# EAGLE design eeprom (EAGLE 9.6.2)
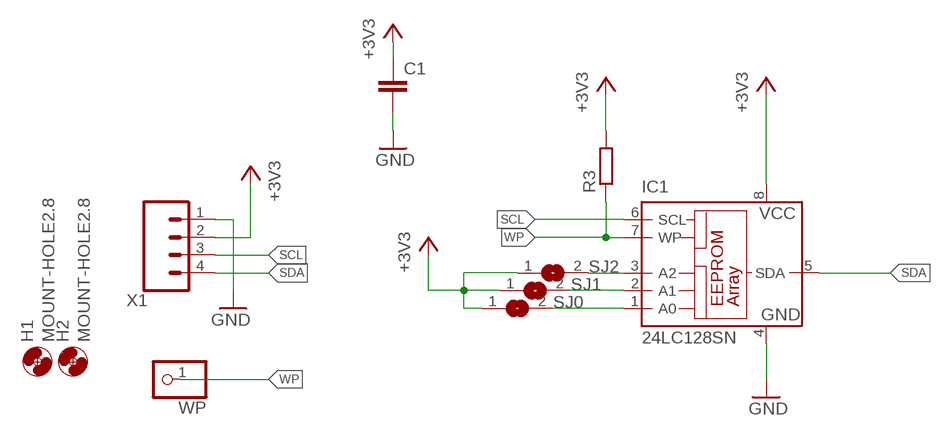
[diagram p0: schematic, sheet 1]

## Parts
C1  C-EUC0805  [C0805]
H1  MOUNT-HOLE2.8  [2,8]
H2  MOUNT-HOLE2.8  [2,8]
IC1  24LC128SN  [SO-08]
R3  R-EU_R0805  [R0805]
SJ0  SJ  [SJ]
SJ1  SJ  [SJ]
SJ2  SJ  [SJ]
WP  PINHD-1X1  [1X01]
X1  JST-XH-04-PIN-ROUND-PAD  [JST-XH-04-PACKAGE-ROUND-PAD]

## Nets
+3V3: C1.1 IC1.8(VCC) R3.2 SJ0.1 SJ1.1 SJ2.1 X1.2
GND: C1.2 IC1.4(GND) X1.1
N$1: IC1.3(A2) SJ2.2
N$2: IC1.2(A1) SJ1.2
N$3: IC1.1(A0) SJ0.2
SCL: IC1.6(SCL) X1.3
SDA: IC1.5(SDA) X1.4
WP: IC1.7(WP) R3.1 WP.1

## Library data of the parts
C1 = rcl:C-EU: CAPACITOR, European symbol; SPICEPREFIX: C
H1 H2 = holes:MOUNT-HOLE: MOUNTING HOLE with drill center marker
IC1 = microchip:24*: Serial EEPROM I2C; MF: MICROCHIP; MPN: 24LC128-I/SNG; OC_FARNELL: 9757937; OC_NEWARK: 30H1511
R3 = rcl:R-EU_: RESISTOR, European symbol; SPICEPREFIX: R
SJ0 SJ1 SJ2 = jumper:SJ: SMD solder JUMPER
WP = pinhead:PINHD-1X1: PIN HEADER
X1 = JST-XH-2.54:JST-XH-04-PIN: JST XH Connector 2 Pin Wire to board connector. Pitch: 2,54 mm, (0.100") Number of pins: 4 Created by Rembrandt Electronics www.rembrandtelectronics.com

## Board
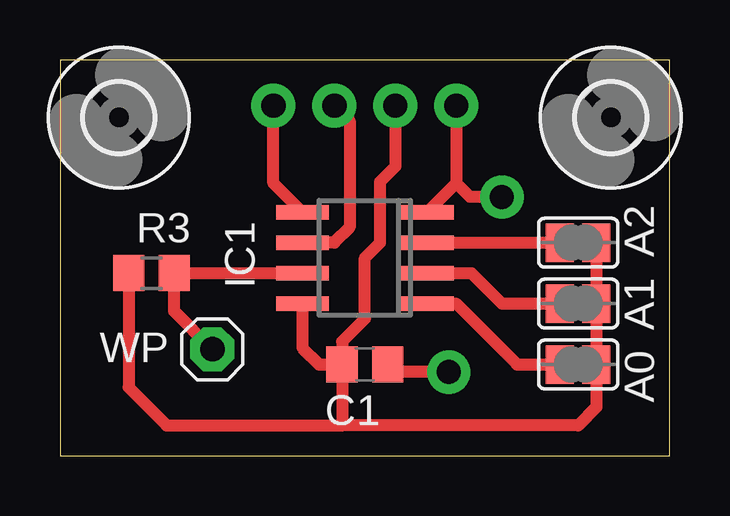
[diagram p1: board, top side]
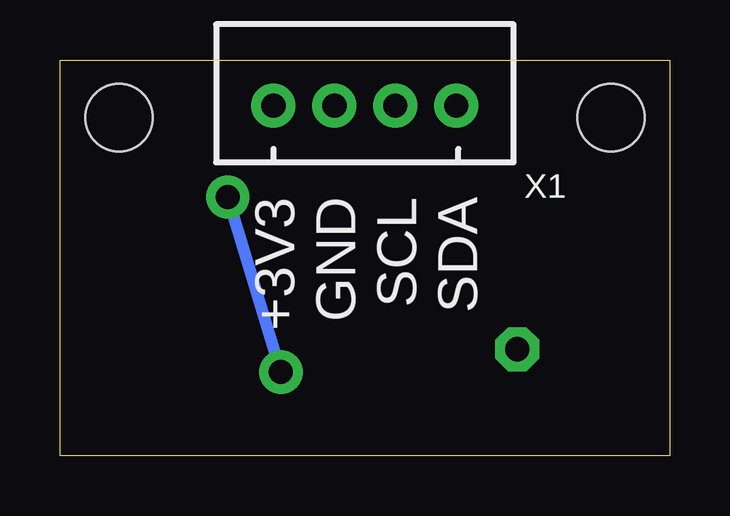
[diagram p2: board, bottom side, seen from below]

Size 25.4 x 16.51 mm. Coordinates in mm from the lower left corner, seen from the top.
Outline: 0,0 25.4,0 25.4,16.51 0,16.51 0,0
Copper layers (1*16): Top 0.035mm / dielectric 1.6mm / Bottom 0.035mm
Design rules "eeprom *": minimum track width 10mil, minimum drill 0.35mm, track to track 10mil, track to pad 10mil, pad to pad 10mil, via to via 10mil, smd to smd 10mil, copper to edge 20mil, drill to drill 10mil, minimum pad ring 10mil, minimum via ring 10mil, stop-mask expansion 4mil, vias tented up to drill 0.6mm, thermal gap 16mil
Holes 2.8 mm at 2.45,14.11 22.95,14.11

### Footprints (pad centres in the part's own frame; a part is rotated, then mirrored left to right if it is on the bottom)
C0805 = smd 1.3 x 1.5: 1 -0.95,0; 2 0.95,0
2,8 = hole 2.8: 0,0
SO-08 = smd 0.6 x 2.2: 1 -1.905,-2.6; 2 -0.635,-2.6; 3 0.635,-2.6; 4 1.905,-2.6; 5 1.905,2.6; 6 0.635,2.6; 7 -0.635,2.6; 8 -1.905,2.6
R0805 = smd 1.3 x 1.5: 1 -0.95,0; 2 0.95,0
SJ = smd 1.168 x 1.6: 1 -0.762,0; 2 0.762,0
1X01 = drill 1.016 octagon: 1 0,0
JST-XH-04-PACKAGE-ROUND-PAD = drill 1.016: 1 -3.81,0; 2 -1.27,0; 3 1.27,0; 4 3.81,0

### Placement (x,y rotation side)
C1  12.7,3.81 0 top
H1  2.45,14.11 0 top
H2  22.95,14.11 0 top
IC1  12.7,8.26 90 top
R3  3.81,7.62 180 top
SJ0  21.59,3.81 180 top
SJ1  21.59,6.35 180 top
SJ2  21.59,8.89 180 top
WP  6.35,4.45 0 top
X1  12.7,14.61 0 bottom

### Tracks (layer width: path | path; a pad name or v marks a point on that pad's centre or on a via)
+3V3
  Top 0.508: X1.2 13.97,12.06 13.34,11.43 13.34,8.89 12.7,8.26 12.7,5.71 11.75,4.76 C1.1 | SJ2.1 SJ1.1 SJ0.1 22.35,2.03 21.59,1.27 11.75,1.27 | C1.1 11.75,1.27 | IC1.8 10.1,4.5 10.79,3.81 C1.1 | R3.2 2.86,2.85 4.45,1.27 11.75,1.27
GND  (via drill 1)
  Top 0.508: v16.19,3.49 13.97,3.49 C1.2 | X1.1 16.51,11.37 | 16.51,11.37 IC1.4 | v18.41,10.79 17.09,10.79 16.51,11.37
  Bottom 0.508: v18.41,10.79 v16.19,3.49
N$1
  Top 0.508: IC1.3 SJ2.2
N$2
  Top 0.508: IC1.2 17.14,7.62 18.41,6.35 SJ1.2
N$3
  Top 0.508: IC1.1 16.51,6.35 19.05,3.81 SJ0.2
SCL
  Top 0.508: X1.3 12.07,13.97 12.07,9.53 11.43,8.89 IC1.6
SDA
  Top 0.508: IC1.5 8.89,11.37 X1.4
WP
  Top 0.508: IC1.7 R3.1 4.76,6.04 WP.1

### Text on the board
tPlace: A2 | A1 | A0
bPlace: SDA | SCL | GND | +3V3